# Altium schematic sheet RF_REVE[2].SchDoc
size A4; SheetNumber: 3; SheetTotal: 3
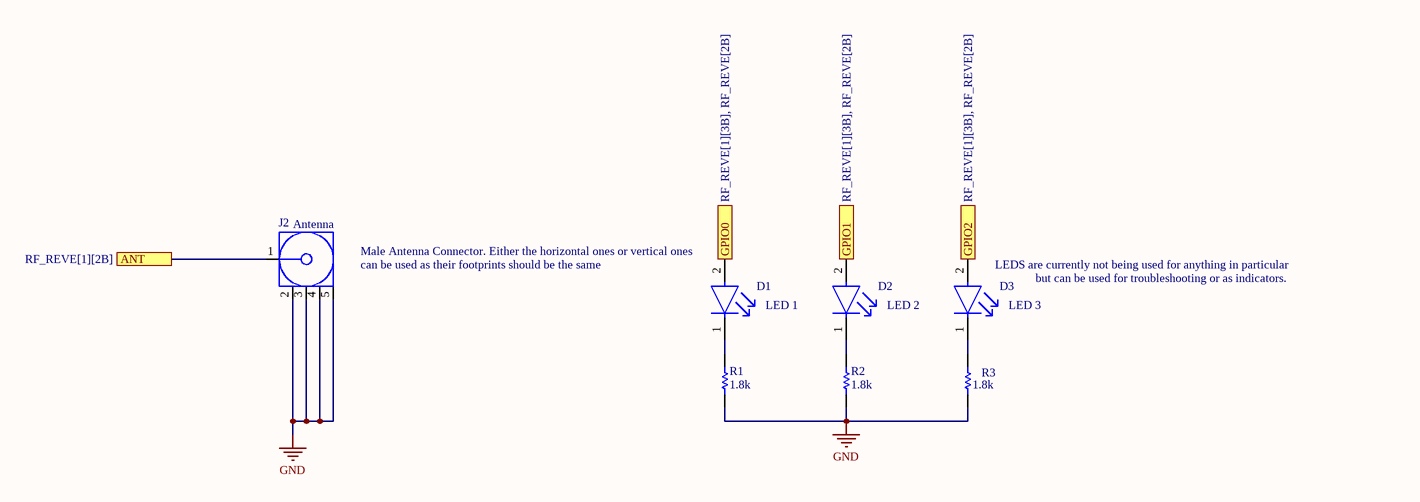
[diagram p0: RF_REVE[2].SchDoc]

## Parts
D1  LED 1  [FP-APTD3216CGCK-MFG]
D2  LED 2  [FP-APTD3216CGCK-MFG]
D3  LED 3  [FP-APTD3216CGCK-MFG]
J2  Antenna  [CINC-142-0701-801_V]
R1  1.8k  [RESC2013X60X35ML10T20]
R2  1.8k  [RESC2013X60X35ML10T20]
R3  1.8k  [RESC2013X60X35ML10T20]

## Ports
ANT (see RF_REVE[1][2B]), GPIO0 (see RF_REVE[1][3B], RF_REVE[2B]), GPIO1 (see RF_REVE[1][3B], RF_REVE[2B]), GPIO2 (see RF_REVE[1][3B], RF_REVE[2B])

## Nets
GND: J2.2 J2.3 J2.4 J2.5 R1.1 R2.1 R3.1
ANT: J2.1 ; port ANT
GPIO0: D1.2(A) ; port GPIO0
GPIO1: D2.2(A) ; port GPIO1
GPIO2: D3.2(A) ; port GPIO2
NetD1_1: D1.1(C) R1.2
NetD2_1: D2.1(C) R2.2
NetD3_1: D3.1(C) R3.2

## Notes on the sheet
- Male Antenna Connector. Either the horizontal ones or vertical ones
- (near J2) can be used as their footprints should be the same
- (near D3) LEDS are currently not being used for anything in particular
- but can be used for troubleshooting or as indicators.

## Library data of the parts
D1-D3 = CMP-2000-05792-2: LED GREEN CLEAR 2SMD; Forward Voltage: 2.1V; Forward Current: 20mA; Luminous Intensity: 300mcd; Number of LEDs: 1; Dominant Wavelength: 570nm; Viewing Angle: 50°; Lead Free: Lead Free; Lens Color: Clear; Mount: Surface Mount; Package Quantity: 2000; Height: 1.8mm; Number of Pins: 2; Test Current: 20mA; Case Code (Metric): 3216; Case/Package: 1206; Case Code (Imperial): 1206; Illumination Color: Green; Color: Green; Width: 1.6mm; Packaging: Tape and Reel; Min Operating Temperature: -40°C; Lens Style: Clear; Max Operating Temperature: 85°C; Length: 3.2mm
J2 = CMP-2000-05490-1: SMA End Launch Jack Receptacle, 50 Ohm, 0 to 18 GHz, -65 to 165 degC, 5-Pin SMD, RoHS, Bulk; Manufacturer: EmersonConnectivitySolutions; Connector Type: JackPCB; Gender: Jack(Female); Impedance: 50Ohms; Brand: Johnson/EmersonConnectivitySolutions; Body Material: Brass; Body Style: Straight; Maximum Frequency: 18GHz; Factory Pack Quantity: 5; Datasheet URL: https://belfuse.com/resources/Johnson/productinformation/pi-142-0701-801.pdf; Datasheet Version: 12/2014; Operating Temperature Range: -65Cto+165C; Mounting Technology: SurfaceMount; RF Series: SMA; Package Reference: 142-0701-801; Product Category: RFConnectors/CoaxialConnectors; Termination Style: Solder; RoHS: Details; Package URL: https://belfuse.com/resources/Johnson/drawings/dr-1420701801.pdf; Series: SMA; Package Description: 5-Pin Surface Mount Device, Body 14.275 x 9.525 mm; Manufacturer URL: http://www.cinch.com/; Contact Plating: Gold; Product: Connectors; Orientation: Straight
R1-R3 = CMP-2001-04564-1: Part Number: RC0805FR-131K8L; Manufacturer: Yageo